# Altium schematic sheet W5200.SchDoc
size A4
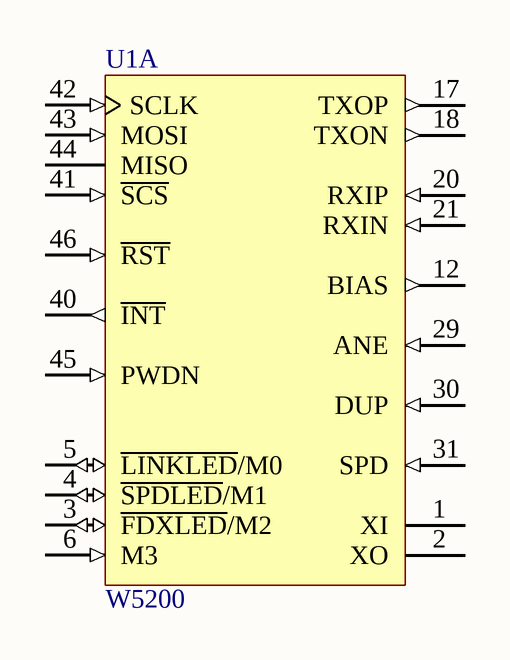
[diagram p0: W5200.SchDoc]

## Parts
U1  W5200  [WIZ-QFN-48_L]  (part A of 2)

## Nets

Not connected (* = marked no-connect by the designer): U1 1(XI) 2(XO) 3(~{FDXLED}/M2) 4(~{SPDLED}/M1) 5(~{LINKLED}/M0) 6(M3) 12(BIAS) 17(TXOP) 18(TXON) 20(RXIP) 21(RXIN) 29(ANE) 30(DUP) 31(SPD) 40(~{INT}) 41(~{SCS}) 42(SCLK) 43(MOSI) 44(MISO) 45(PWDN) 46(~{RST})

## Library data of the parts
U1 = CMP-2000-07410-1: ﻿iEthernet W5200, 2.97 to 3.63 V, -40 to 85 degC, 48-Pin QFN, RoHS, Tape and Reel; Manufacturer: WIZnet; Loopback Mode: Internal; Host Interface: SPI; Auto-Negotiation: Yes; Typical Operating Supply Voltage: 3.63Vdc; Data Rate: 10Mbit/s,100Mbit/s; Network Interface: MDI/MDIX; Physical Network Type: 100BaseTX,10BaseT; Communication Mode: FullDuplex,HalfDuplex; Package Reference: QFN-48; Datasheet Version: Rev. 1.2.1, 08/2011; Height: 0.7mm; Dimensions: 7x7x0.7mm; Minimum Operating Temperature: -40C; Width: 7mm; Manufacturer URL: http://www.wiznet.co.kr/; Pin Count: 48; Datasheet URL: https://datasheet.ciiva.com/19465/2132496-19465995.pdf; Maximum Operating Temperature: +85C; Package Description: 48-Pin Quad Flat No-lead Package, Body 7 x 7 mm, Pitch 0.5 mm; Mounting Technology: SurfaceMount; Length: 7mm; Package Type: QFN; Mounting Type: SurfaceMount